# Altium schematic sheet EEPROM_Temp_LEDs.SchDoc
size A3
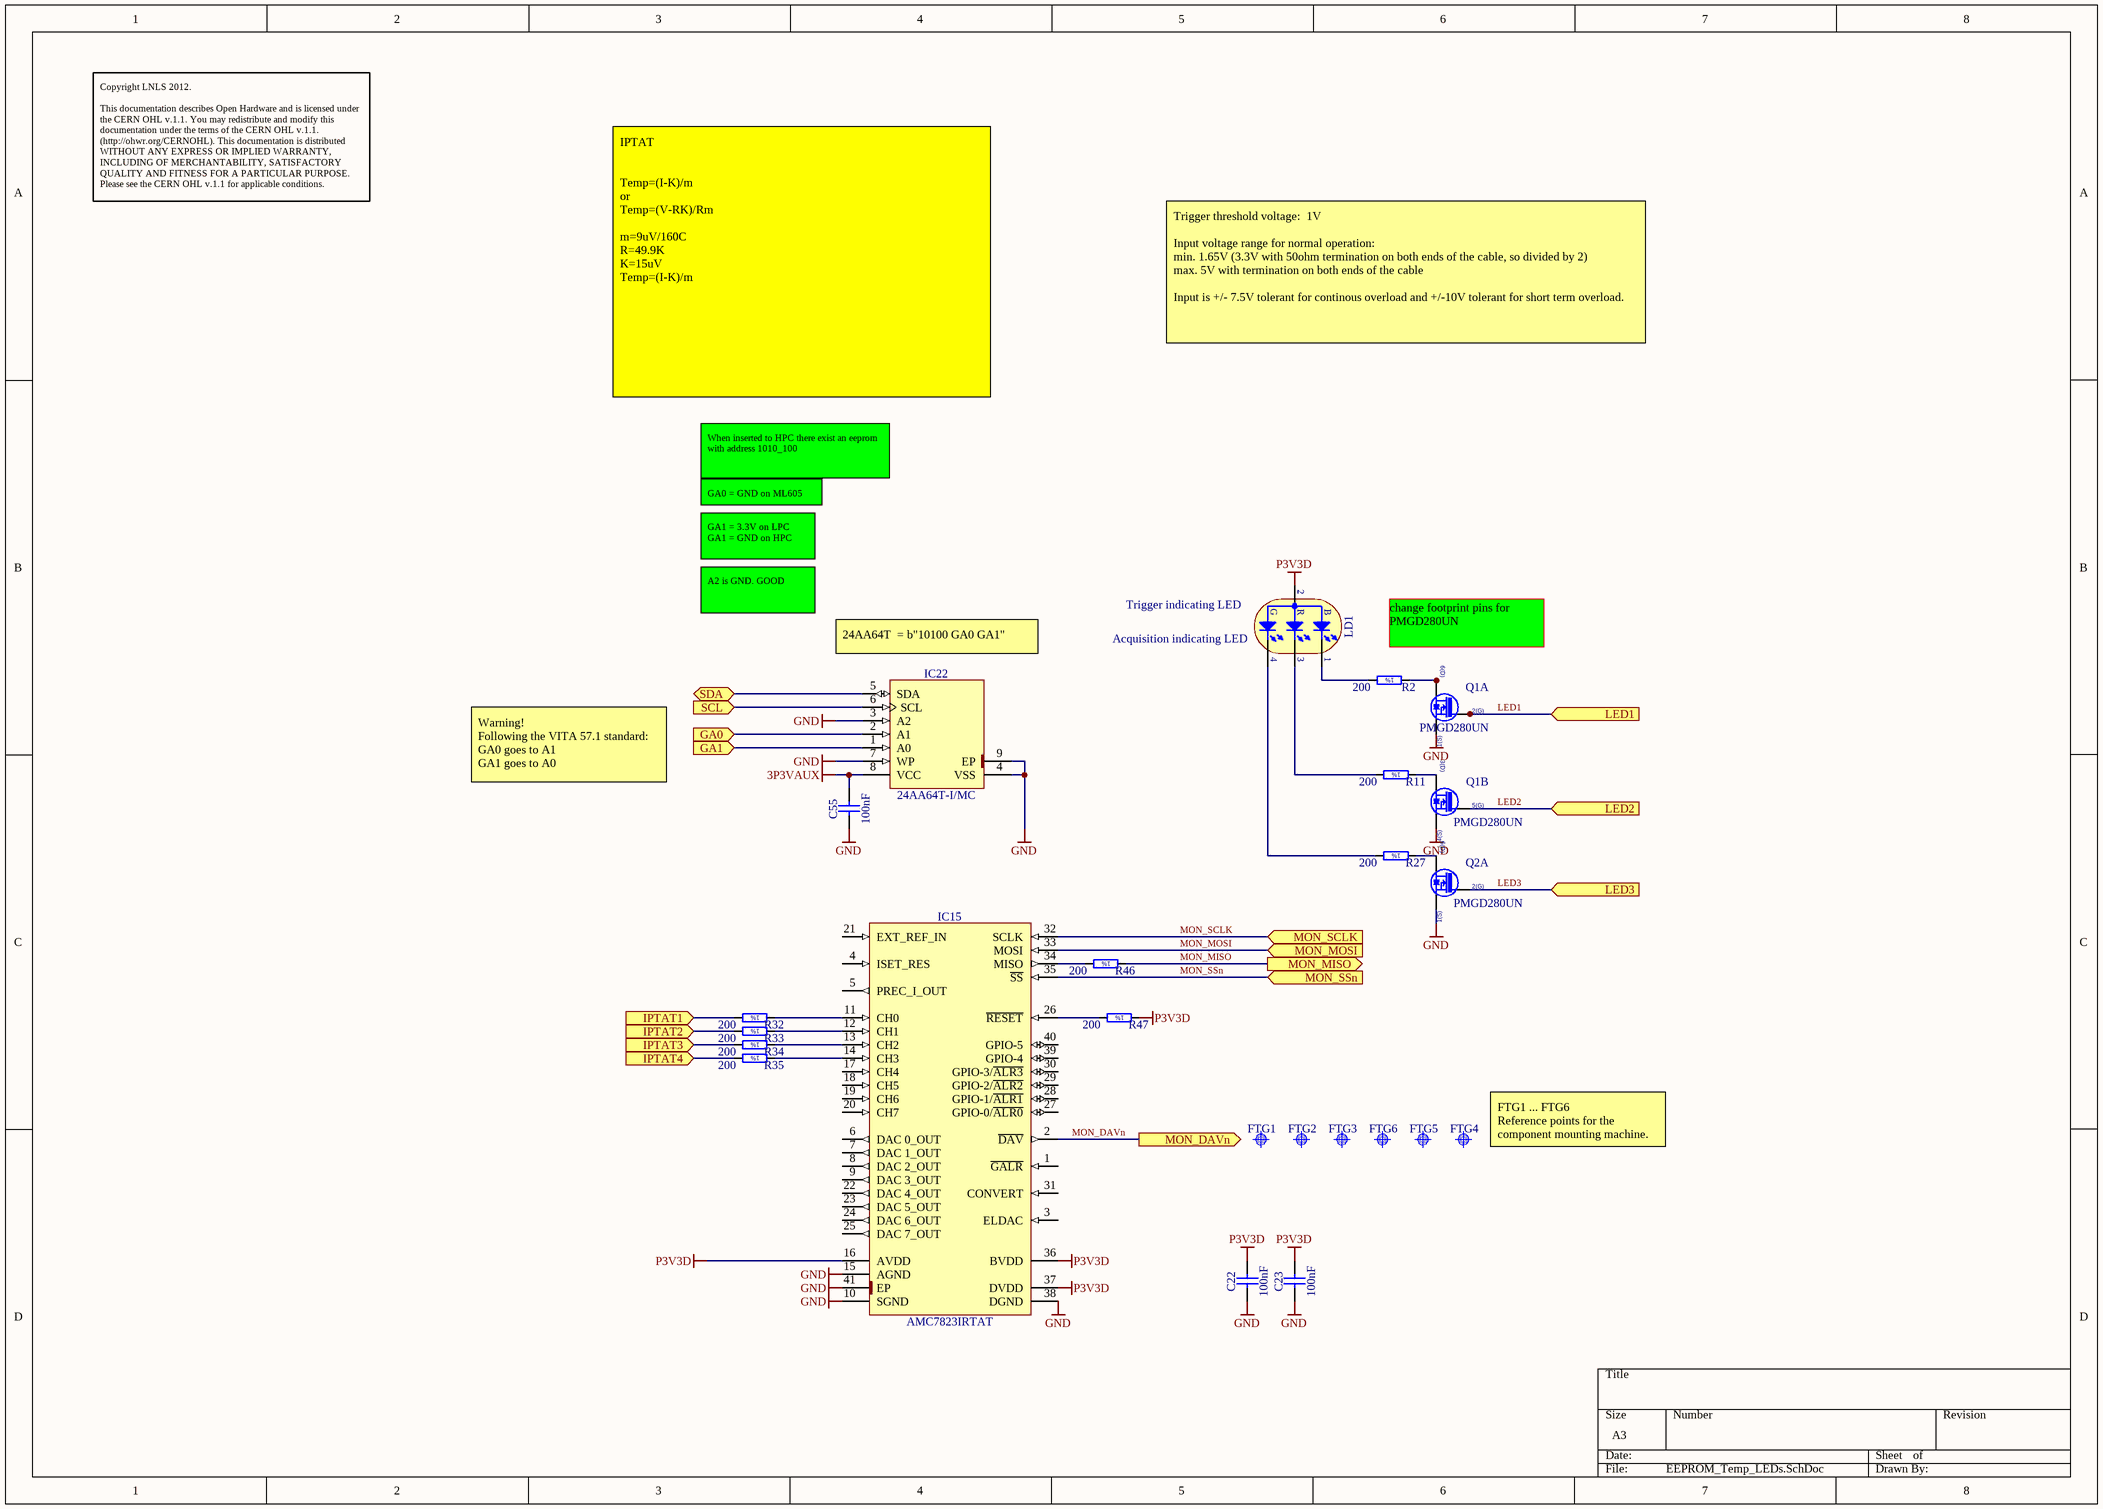
[diagram p0: EEPROM_Temp_LEDs.SchDoc]

## Parts
C22  100nF  [CAPC0603X33N]
C23  100nF  [CAPC0603X33N]
C55  100nF  [CAPC0603X33N]
FTG1  Use only in PCB  [FIDUCIAL_TOP_S100-200]  (value not drawn)
FTG2  Use only in PCB  [FIDUCIAL_TOP_S100-200]  (value not drawn)
FTG3  Use only in PCB  [FIDUCIAL_TOP_S100-200]  (value not drawn)
FTG4  Use only in PCB  [FIDUCIAL_TOP_S100-200]  (value not drawn)
FTG5  Use only in PCB  [FIDUCIAL_TOP_S100-200]  (value not drawn)
FTG6  Use only in PCB  [FIDUCIAL_TOP_S100-200]  (value not drawn)
IC15  AMC7823IRTAT  [QFN50P600X600X80-41N-S425]
IC22  24AA64T-I/MC  [SON50P300X200X100-9N-R175X155]
LD1  (no value)  [LED_AVAGO_HSMF-C113]
Q1  PMGD280UN  [SOT65P210X110-6N]  (parts A,B of 2)
Q2  PMGD280UN  [SOT65P210X110-6N]  (part A of 2)
R2  200  [RESC1005X40N]
R11  200  [RESC1005X40N]
R27  200  [RESC1005X40N]
R32  200  [RESC1005X40N]
R33  200  [RESC1005X40N]
R34  200  [RESC1005X40N]
R35  200  [RESC1005X40N]
R46  200  [RESC1005X40N]
R47  200  [RESC1005X40N]

## Ports
GA0 (in), GA1 (in), IPTAT1 (in), IPTAT2 (in), IPTAT3 (in), IPTAT4 (in), LED1 (in), LED2 (in), LED3 (in), MON_DAVn (out), MON_MISO (out), MON_MOSI (in), MON_SCLK (in), MON_SSn (in), SCL (in), SDA (bidir)

## Nets
3P3VAUX: C55.2 IC22.8(VCC)
GND: C22.1 C23.1 C55.1 IC15.10(SGND) IC15.15(AGND) IC15.38(DGND) IC15.41(EP) IC22.3(A2) IC22.4(VSS) IC22.7(WP) IC22.9(EP) Q1.1(S) Q1.4(S) Q2.1(S)
P3V3D: C22.2 C23.2 IC15.16(AVDD) IC15.36(BVDD) IC15.37(DVDD) LD1.2(AC) R47.1
GA0: IC22.2(A1) ; port GA0
GA1: IC22.1(A0) ; port GA1
IPTAT1: R32.2 ; port IPTAT1
IPTAT2: R33.2 ; port IPTAT2
IPTAT3: R34.2 ; port IPTAT3
IPTAT4: R35.2 ; port IPTAT4
LED1: Q1.2(G) ; port LED1
LED2: Q1.5(G) ; port LED2
LED3: Q2.2(G) ; port LED3
MON_DAVn: IC15.2(~{DAV}) ; port MON_DAVn
MON_MISO: R46.1 ; port MON_MISO
MON_MOSI: IC15.33(MOSI) ; port MON_MOSI
MON_SCLK: IC15.32(SCLK) ; port MON_SCLK
MON_SSn: IC15.35(~{SS}) ; port MON_SSn
SCL: IC22.6(SCL) ; port SCL
SDA: IC22.5(SDA) ; port SDA
NetIC15_11: IC15.11(CH0) R32.1
NetIC15_12: IC15.12(CH1) R33.1
NetIC15_13: IC15.13(CH2) R34.1
NetIC15_14: IC15.14(CH3) R35.1
NetIC15_26: IC15.26(~{RESET}) R47.2
NetIC15_34: IC15.34(MISO) R46.2
NetLD1_1: LD1.1(CB) R2.2
NetLD1_3: LD1.3(CR) R11.2
NetLD1_4: LD1.4(CG) R27.2
NetQ1_3: Q1.3(D) R11.1
NetQ1_6: Q1.6(D) R2.1
NetQ2_6: Q2.6(D) R27.1

Not connected (* = marked no-connect by the designer): IC15 1(~{GALR}) 3(ELDAC) 4(ISET_RES) 5(PREC_I_OUT) 6(DAC_0_OUT) 7(DAC_1_OUT) 8(DAC_2_OUT) 9(DAC_3_OUT) 17(CH4) 18(CH5) 19(CH6) 20(CH7) 21(EXT_REF_IN) 22(DAC_4_OUT) 23(DAC_5_OUT) 24(DAC_6_OUT) 25(DAC_7_OUT) 27(GPIO-0/~{ALR0}) 28(GPIO-1/~{ALR1}) 29(GPIO-2/~{ALR2}) 30(GPIO-3/~{ALR3}) 31(CONVERT) 39(GPIO-4) 40(GPIO-5)

## Notes on the sheet
- Copyright LNLS 2012.
  This documentation describes Open Hardware and is licensed under the CERN OHL v.1.1. You may redistribute and modify this documentation under the terms of the CERN OHL v.1.1. (http://ohwr.org/CERNOHL). This documentation is distributed WITHOUT ANY EXPRESS OR IMPLIED WARRANTY, INCLUDING OF MERCHANTABILITY, SATISFACTORY QUALITY AND FITNESS FOR A PARTICULAR PURPOSE. Please see the CERN OHL v.1.1 for applicable conditions.
- Trigger threshold voltage:  1V
  Input voltage range for normal operation:
  min. 1.65V (3.3V with 50ohm termination on both ends of the cable, so divided by 2)
  max. 5V with termination on both ends of the cable
  Input is +/- 7.5V tolerant for continous overload and +/-10V tolerant for short term overload.
- IPTAT
  Temp=(I-K)/m
  or
  Temp=(V-RK)/Rm
  m=9uV/160C
  R=49.9K
  K=15uV
  Temp=(I-K)/m
- GA0 = GND on ML605
- When inserted to HPC there exist an eeprom with address 1010_100
- GA1 = 3.3V on LPC
  GA1 = GND on HPC
- A2 is GND. GOOD
- (near IC22) 24AA64T  = b"10100 GA0 GA1"
- (near LD1) Acquisition indicating LED
- (near LD1) Trigger indicating LED
- change footprint pins for PMGD280UN
- Warning!
  Following the VITA 57.1 standard:
  GA0 goes to A1
  GA1 goes to A0
- (near FTG4) FTG1 ... FTG6
  Reference points for the component mounting machine.
- (in symbol LED_AVAGO_HSMF-C113) G; R; B
- (in symbol PMGD280UN, part A) 6(D); 2(G); 1(S)
- (in symbol PMGD280UN, part B) 3(D); 5(G); 4(S)
- (in symbol R0402_200R_1%_0.0625W_100PPM) 1%

## Library data of the parts
C22 C23 C55 = CC0201_100NF_6.3V_10%_X5R: Non-polarised capacitor; Part Description: SMD Multilayer Chip Ceramic Capacitor; Manufacturer: GENERIC; Manufacturer1 Part Number: 02016D104KAT2A; Voltage: 6.3V; TC: X5R; Tolerance: ±10%; Table: Capacitors SMD; Part Number: CC0201_100NF_6.3V_10%_X5R; Component Kind: Standard; Component Type: Standard; Pin Count: 2; Value: 100nF; Status: Not Recommended; Manufacturer Part Number: CC0201_100NF_6.3V_10%_X5R; Case: 0201; Mounted: Yes; Socket: No; SMD: Yes; Manufacturer1 Example: AVX; Manufacturer1 ComponentHeight: 0.33mm; HelpURL: \\cern.ch\dfs\Applications\Altium\Datasheets\CC0201_X5R_AVX.pdf; Author: CERN DEM JLC; CreateDate: 03/12/2007; LatestRevisionDate: 03/12/2007; Sense: No
FTG1-FTG6 = FIDUCIAL_TARGET_S100-200: Fiducial Target; Part Description: Scare Fiducial Target, Top Layer, 1.0mm, Top Sloder 2.0mm, Keepout =2.0mm; Mounted: No; Table: Pads; Part Number: FIDUCIAL_TARGET_S100-200; Component Kind: Standard (No BOM); Component Type: Standard (No BOM); Pin Count: 1; Family: Fiducial; Socket: No; SMD: Yes; Status: None; ComponentHeight: 0mm; Author: CERN DEM JLC; CreateDate: 09.02.2010; LatestRevisionDate: 09.02.2010; PackageDescription: Scare Fiducial Target, Top Layer, 1.0mm, Top Sloder 2.0mm, Keepout =2.0mm
IC15 = AMC7823IRTAT: Integrated, Multichannel ADC and DAC for Analog Monitoring & Control; Manufacturer: TEXAS INSTRUMENTS; Table: Analog & Interface; Bonding: No; PressFit: No; Part Number: AMC7823IRTAT; Component Kind: Standard; Component Type: Standard; Device: AMC7823IRTAT; PackageDescription: QFN, 0.50mm Pitch, Square; 40 Pin, 6.00mm L X 6.00mm W X 0.80mm H body (w/Thermal Tab 4.25 x 4.25mm), IPC Medium Density; Part Description: Integrated, Multichannel ADC and DAC for Analog Monitoring & Control; Manufacturer Part Number: AMC7823IRTAT; Pin Count: 41; Case: QFN40; Mounted: Yes; Socket: No; SMD: Yes; ComponentHeight: 0.8mm; Author: CERN DEM JLC; HelpURL: \\cern.ch\dfs\Applications\Altium\Datasheets\AMC7823IRTAT.pdf; CreateDate: 11/10/2012; LatestRevisionDate: 11/10/2012; Sense: No
IC22 = 24AA64T-I/MC: 1.7-5.5V 64K I2C Serial EEPROM; Part Description: 1.7V-5.5V, 64K  (8K x 8-bit) I2C Serial EEPROM; Manufacturer: MICROCHIP TECHNOLOGY; Table: Logic; Bonding: No; PressFit: No; Part Number: 24AA64T-I/MC; Component Kind: Standard; Component Type: Standard; Device: 24AA64T-I/MC; Footprint: SON50P300X200X100-9N-S175X155; PackageDescription: SON (DFN), 0.50mm pitch, 8 pin, 2mm X 3mm X 1.00mm H body (w/thermal tab 1.75 X 1.55mm),  IPC Medium Density; Manufacturer Part Number: 24AA64T-I/MC; Pin Count: 9; Case: DFN8; Mounted: Yes; Socket: No; SMD: Yes; ComponentHeight: 1mm; HelpURL: \\cern.ch\dfs\Applications\Altium\Datasheets\24AA64T-I-MC.pdf; Author: CERN DEM JLC; CreateDate: 18/11/2009; LatestRevisionDate: 24/01/2011; Sense: No
LD1 = LED_AVAGO_HSMF-C113: Tricolor LEDs 1 Cathode Blue, 2 Common Anode, 3 Cathode Red, 4 Cathode Green; Part Description: Right Angle Tricolor (Blue, Red, Green) Surface Mount ChipLED; Manufacturer: AVAGO TECHNOLOGIES; Color: Blue/Red/Green; Table: LEDs & Displays; Bonding: No; PressFit: No; Part Number: LED_AVAGO_HSMF-C113; Component Kind: Standard; Component Type: Standard; PackageDescription: Right Angle Tricolor Surface Mount ChipLED, Body 2.5x1mm; Manufacturer Part Number: HSMF-C113; Pin Count: 4; Mounted: Yes; Socket: No; SMD: Yes; ComponentHeight: 1mm; HelpURL: \\cern.ch\dfs\Applications\Altium\Datasheets\LED_AVAGO_HSMF-C113.pdf; Author: CERN DEM JLC; CreateDate: 29/09/2010; LatestRevisionDate: 29/09/2010; Sense: No
Q1 Q2 = PMGD280UN: Dual N-Channel micro TrenchMOS™ Ultra Low Level FET; Manufacturer: NXP SEMICONDUCTORS; Part Description: 20V 870mA Dual N-Channel micro TrenchMOS™ Ultra Low Level FET; Bonding: No; PressFit: No; Part Number: PMGD280UN; Author: CERN DEM JLC; Case: SOT363; ComponentHeight: 1.1mm; Component Type: Standard; CreateDate: 19/11/2014; Device: PMGD280UN; HelpURL: \\cern.ch\dfs\Applications\Altium\Datasheets\PMGD280UN.pdf; LatestRevisionDate: 19/11/2014; Manufacturer Part Number: PMGD280UN; Mounted: Yes; PackageDescription: SOT363, SC70-6, SOT, 0.65mm Pitch, 6 pin, 1.25mm W X 2.00mm L X 1.10mm H, IPC Medium Density; Pin Count: 6; Sense: No; SMD: Yes; Socket: No
R2 R11 R27 R32-R35 R46 R47 = R0402_200R_1%_0.0625W_100PPM: Resistor - 1%; Part Description: General Purpose Thick Film Chip Resistor; Manufacturer: GENERIC; Manufacturer1 Part Number: 232270672001L; TC: ±100ppm/°C; Table: Resistors SMD; Part Number: R0402_200R_1%_0.0625W_100PPM; Component Kind: Standard; Component Type: Standard; Pin Count: 2; Value: 200; Status: Not recommended; Power: 0.0625W; Tolerance: ±1%; Manufacturer Part Number: R0402_200R_1%_0.0625W_100PPM; Case: 0402; Mounted: Yes; Socket: No; SMD: Yes; Manufacturer1 Example: YAGEO PHYCOMP; Manufacturer1 ComponentHeight: 0.4mm; HelpURL: \\cern.ch\dfs\Applications\Altium\Datasheets\R0402_Phycomp_RC0402.pdf; Author: CERN DEM JLC; CreateDate: 03/12/2007; LatestRevisionDate: 17/10/2012; Sense: No